# Altium schematic sheet 2Motors_ctrl_2S.SchDoc: Init Title in DocParam
size A4; Organization: Use Organization_Name in ProjParam; Address1: Eliot Ferragni; Address2: STI-IMT-LSRO; Address3: EPFL; Address4: CH-1015 LAUSANNE; DocumentNumber: 6; Revision: A; SheetNumber: 6; SheetTotal: 7; ApprovedBy: Init ApprovedBy in DocParam; CheckedBy: Init CheckedBy in DocParam; Author: Init Author in DocParam; CompanyName: Init CompanyName in DocParam; DrawnBy: Init DrawBy in DocParam; Engineer: Init Engineer in DocParam; Title2: Init Title2 in DocParam; DocumentName: Init DocumentName in DocParam; ProjectName: Init ProjectName in DocParam
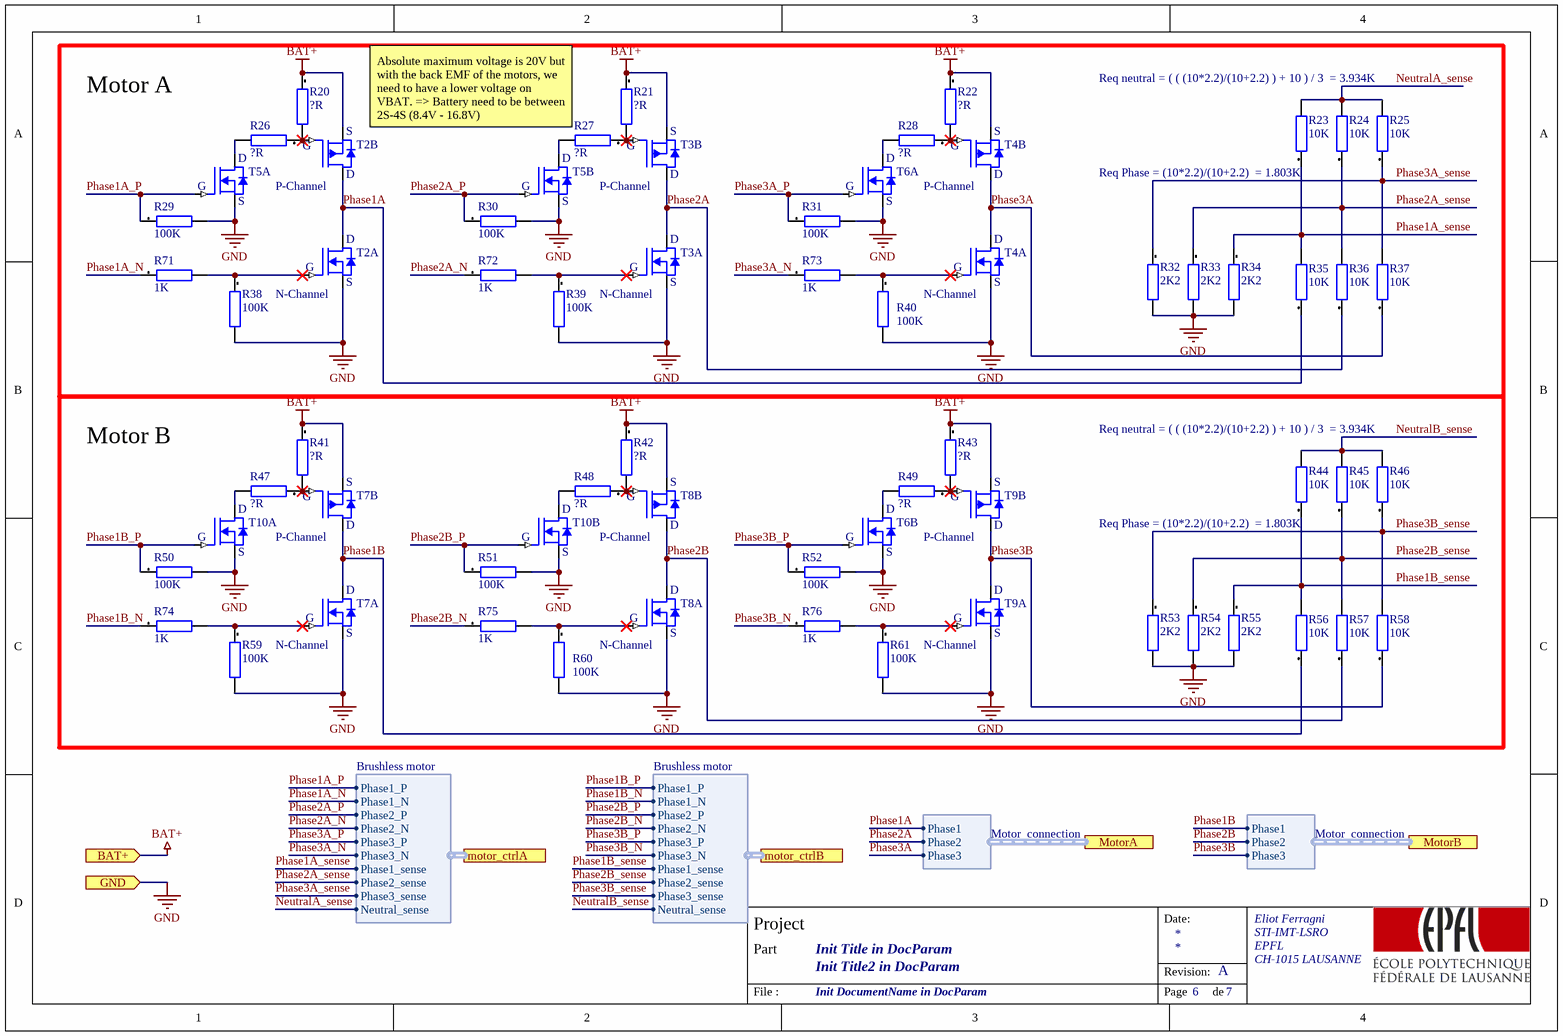
[diagram p0: 2Motors_ctrl_2S.SchDoc]

## Parts
R20  ?R  [RESC1608X06N]
R21  ?R  [RESC1608X06N]
R22  ?R  [RESC1608X06N]
R23  10K  [RESC1608X06N]
R24  10K  [RESC1608X06N]
R25  10K  [RESC1608X06N]
R26  ?R  [RESC1608X06N]
R27  ?R  [RESC1608X06N]
R28  ?R  [RESC1608X06N]
R29  100K  [RESC1608X06N]
R30  100K  [RESC1608X06N]
R31  100K  [RESC1608X06N]
R32  2K2  [RESC1608X06N]
R33  2K2  [RESC1608X06N]
R34  2K2  [RESC1608X06N]
R35  10K  [RESC1608X06N]
R36  10K  [RESC1608X06N]
R37  10K  [RESC1608X06N]
R38  100K  [RESC1608X06N]
R39  100K  [RESC1608X06N]
R40  100K  [RESC1608X06N]
R41  ?R  [RESC1608X06N]
R42  ?R  [RESC1608X06N]
R43  ?R  [RESC1608X06N]
R44  10K  [RESC1608X06N]
R45  10K  [RESC1608X06N]
R46  10K  [RESC1608X06N]
R47  ?R  [RESC1608X06N]
R48  ?R  [RESC1608X06N]
R49  ?R  [RESC1608X06N]
R50  100K  [RESC1608X06N]
R51  100K  [RESC1608X06N]
R52  100K  [RESC1608X06N]
R53  2K2  [RESC1608X06N]
R54  2K2  [RESC1608X06N]
R55  2K2  [RESC1608X06N]
R56  10K  [RESC1608X06N]
R57  10K  [RESC1608X06N]
R58  10K  [RESC1608X06N]
R59  100K  [RESC1608X06N]
R60  100K  [RESC1608X06N]
R61  100K  [RESC1608X06N]
R71  1K  [RESC1608X06N]
R72  1K  [RESC1608X06N]
R73  1K  [RESC1608X06N]
R74  1K  [RESC1608X06N]
R75  1K  [RESC1608X06N]
R76  1K  [RESC1608X06N]
T2  ECH8668-TL-H  [8-SMD Flat lead]  (value not drawn)  (parts A,B of 2)
T3  ECH8668-TL-H  [8-SMD Flat lead]  (value not drawn)  (parts A,B of 2)
T4  ECH8668-TL-H  [8-SMD Flat lead]  (value not drawn)  (parts A,B of 2)
T5  PMDXB550UNEZ  [DFN1010B-6]  (value not drawn)  (parts A,B of 2)
T6  PMDXB550UNEZ  [DFN1010B-6]  (value not drawn)  (parts A,B of 2)
T7  ECH8668-TL-H  [8-SMD Flat lead]  (value not drawn)  (parts A,B of 2)
T8  ECH8668-TL-H  [8-SMD Flat lead]  (value not drawn)  (parts A,B of 2)
T9  ECH8668-TL-H  [8-SMD Flat lead]  (value not drawn)  (parts A,B of 2)
T10  PMDXB550UNEZ  [DFN1010B-6]  (value not drawn)  (parts A,B of 2)

## Blocks framed on the sheet
Motor A: R20-R40 R71-R73 T2-T6
Motor B: R41-R61 R74-R76 T6-T10

## Ports
BAT+ (in), GND (in), motor_ctrlA (harness Brushless motor), motor_ctrlB (harness Brushless motor), MotorA (harness Motor_connection), MotorB (harness Motor_connection)

## Harnesses
Brushless motor: Phase1_P, Phase1_N, Phase2_P, Phase2_N, Phase3_P, Phase3_N, Phase1_sense, Phase2_sense, Phase3_sense, Neutral_sense
Motor_connection: Phase1, Phase2, Phase3

## Nets
BAT+: R20.1 R21.1 R22.1 R41.1 R42.1 R43.1 T2.3(S) T3.3(S) T4.3(S) T7.3(S) T8.3(S) T9.3(S) ; port BAT+
GND: R29.2 R30.2 R31.2 R32.2 R33.2 R34.2 R38.2 R39.2 R40.2 R50.2 R51.2 R52.2 R53.2 R54.2 R55.2 R59.2 R60.2 R61.2 T2.1(S) T3.1(S) T4.1(S) T5.1(S) T5.4(S) T6.1(S) T6.4(S) T7.1(S) T8.1(S) T9.1(S) T10.1(S) T10.4(S) ; port GND
NeutralA_sense: R23.2 R24.2 R25.2 ; port motor_ctrlA.Neutral_sense
NeutralB_sense: R44.2 R45.2 R46.2 ; port motor_ctrlB.Neutral_sense
Phase1A: R35.1 T2.5(D) T2.6(D) ; port MotorA.Phase1
Phase1A_N: R71.1 ; port motor_ctrlA.Phase1_N
Phase1A_P: R29.1 T5.2(G) ; port motor_ctrlA.Phase1_P
Phase1A_sense: R23.1 R34.1 R35.2 ; port motor_ctrlA.Phase1_sense
Phase1B: R56.1 T7.5(D) T7.6(D) ; port MotorB.Phase1
Phase1B_N: R74.1 ; port motor_ctrlB.Phase1_N
Phase1B_P: R50.1 T10.2(G) ; port motor_ctrlB.Phase1_P
Phase1B_sense: R44.1 R55.1 R56.2 ; port motor_ctrlB.Phase1_sense
Phase2A: R36.1 T3.5(D) T3.6(D) ; port MotorA.Phase2
Phase2A_N: R72.1 ; port motor_ctrlA.Phase2_N
Phase2A_P: R30.1 T5.5(G) ; port motor_ctrlA.Phase2_P
Phase2A_sense: R24.1 R33.1 R36.2 ; port motor_ctrlA.Phase2_sense
Phase2B: R57.1 T8.5(D) T8.6(D) ; port MotorB.Phase2
Phase2B_N: R75.1 ; port motor_ctrlB.Phase2_N
Phase2B_P: R51.1 T10.5(G) ; port motor_ctrlB.Phase2_P
Phase2B_sense: R45.1 R54.1 R57.2 ; port motor_ctrlB.Phase2_sense
Phase3A: R37.1 T4.5(D) T4.6(D) ; port MotorA.Phase3
Phase3A_N: R73.1 ; port motor_ctrlA.Phase3_N
Phase3A_P: R31.1 T6.2(G) ; port motor_ctrlA.Phase3_P
Phase3A_sense: R25.1 R32.1 R37.2 ; port motor_ctrlA.Phase3_sense
Phase3B: R58.1 T9.5(D) T9.6(D) ; port MotorB.Phase3
Phase3B_N: R76.1 ; port motor_ctrlB.Phase3_N
Phase3B_P: R52.1 T6.5(G) ; port motor_ctrlB.Phase3_P
Phase3B_sense: R46.1 R53.1 R58.2 ; port motor_ctrlB.Phase3_sense
NetR20_2: R20.2 R26.1 T2.4(G)
NetR21_2: R21.2 R27.1 T3.4(G)
NetR22_2: R22.2 R28.1 T4.4(G)
NetR26_2: R26.2 T5.6(D)
NetR27_2: R27.2 T5.3(D)
NetR28_2: R28.2 T6.6(D)
NetR38_1: R38.1 R71.2 T2.2(G)
NetR39_1: R39.1 R72.2 T3.2(G)
NetR40_1: R40.1 R73.2 T4.2(G)
NetR41_2: R41.2 R47.1 T7.4(G)
NetR42_2: R42.2 R48.1 T8.4(G)
NetR43_2: R43.2 R49.1 T9.4(G)
NetR47_2: R47.2 T10.6(D)
NetR48_2: R48.2 T10.3(D)
NetR49_2: R49.2 T6.3(D)
NetR59_1: R59.1 R74.2 T7.2(G)
NetR60_1: R60.1 R75.2 T8.2(G)
NetR61_1: R61.1 R76.2 T9.2(G)

## Notes on the sheet
- Req neutral = ( ( (10*2.2)/(10+2.2) ) + 10 ) / 3  = 3.934K
- (near R27) Absolute maximum voltage is 20V but with the back EMF of the motors, we need to have a lower voltage on VBAT. => Battery need to be between 2S-4S (8.4V - 16.8V)
- Req Phase = (10*2.2)/(10+2.2)  = 1.803K
- Date:
- Project
- Part
- Revision:
- File :
- Page
- de
- (in symbol ECH8668-TL-H, part A) N-Channel
- (in symbol ECH8668-TL-H, part B) P-Channel

## Library data of the parts
R20-R61 R71-R76 = TBD[[/\]]0603[[/\]]1: Resistor ToDo 0603; Preference: 1; Currentie: CHF; Size: 0603; Footprint Acort: 0603; ROHS: True; DateLastUpdate: 2012-11-19 / 14:13:33
T2-T4 T7-T9 = ECH8668-TL-H: MOSFET N/P-CH 20V 7.5A/5A ECH8; Manufacturer: ON Semiconductor; FET Type: N and P-Channel; FET Feature: Logic Level Gate; Current - Continuous Drain (Id) @ 25°C: 7.5A, 5A; Rds On (Max) @ Id, Vgs: 17 mOhm @ 4A, 4.5V; Gate Charge (Qg) (Max) @ Vgs: 10.8nC @ 4.5V; Input Capacitance (Ciss) (Max) @ Vds: 1060pF @ 10V; Power - Max: 1.5W; Supplier 1: Digi-Key; Manufacturer Part Number: ECH8668-TL-H; RoHS: RoHS Compliant; Category: Discrete Semiconductor Products; Stock 1: 3111; Pricing 1: 1=0.93, 10=0.811, 100=0.6259, 500=0.46362, 1000=0.37089 (USD); Packaging: Cut Tape (CT); Part Status: Active; Drain to Source Voltage (Vdss): 20V; Vgs(th) (Max) @ Id: -; Operating Temperature: 150°C (TJ); Mounting Type: Surface Mount; Package / Case: 8-SMD, Flat Lead; Supplier Device Package: 8-ECH; ComponentLink1URL: http://www.onsemi.com/pub/Collateral/ECH8668-D.PDF; ComponentLink1Description: http://www.onsemi.com/pub/Collateral/ECH8668-D.PDF; Supplier Part Number 1: ECH8668-TL-HOSCT-ND
T5 T6 T10 = PMDXB550UNEZ: DUAL N-CHANNEL 30V; Manufacturer: NXP Semiconductors; Continuous Drain Current (ID): 590mA; Max Power Dissipation: 285mW; Rds On Max: 670mR; Input Capacitance: 30.3pF; FET Type: 2 N-Channel; Supplier 1: Digi-Key; Stock 1: 5582; Pricing 1: 1=0.48, 10=0.379, 100=0.2601, 500=0.17838, 1000=0.13379 (USD); Mount: Surface Mount; Min Operating Temperature: -55°C; Max Operating Temperature: 150°C; Drain to Source Voltage (Vdss): 30V; Packaging: Tape and Reel; Supplier Part Number 1: 1727-2277-1-ND; Manufacturer Part Number: PMDXB550UNEZ